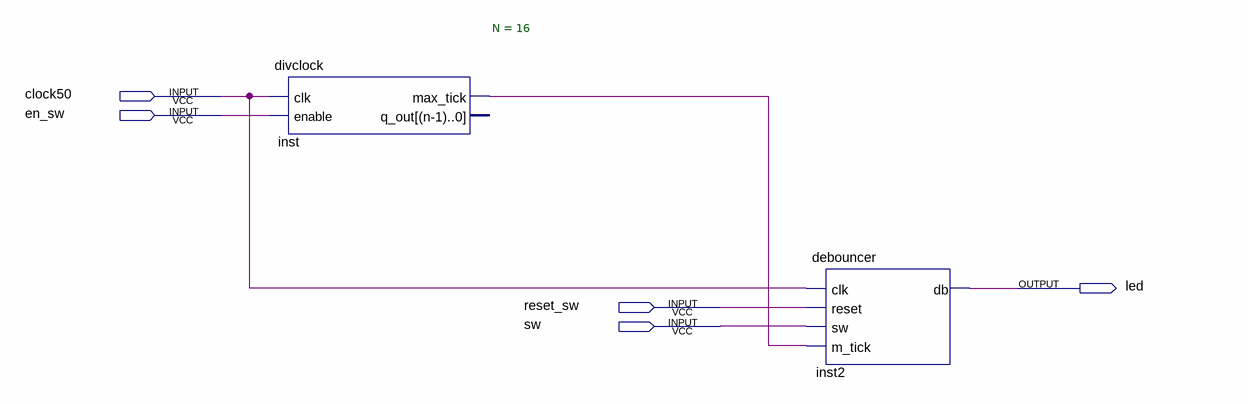
[diagram p0: schematic sheet]
// Quartus schematic top.bdf as structural Verilog: 2 symbols, 5 pins
module top (
  input  clock50,
  input  en_sw,
  input  reset_sw,
  input  sw,
  output led
);

  wire inst_max_tick;

  divclock #(.N(16)) inst (.clk(clock50), .enable(en_sw), .max_tick(inst_max_tick));  // open: q_out
  debouncer inst2 (.clk(clock50), .reset(reset_sw), .sw(sw), .m_tick(inst_max_tick), .db(led));
endmodule
